# Altium schematic sheet Power Regulator.SchDoc
size A4; SheetNumber: 2; SheetTotal: 9
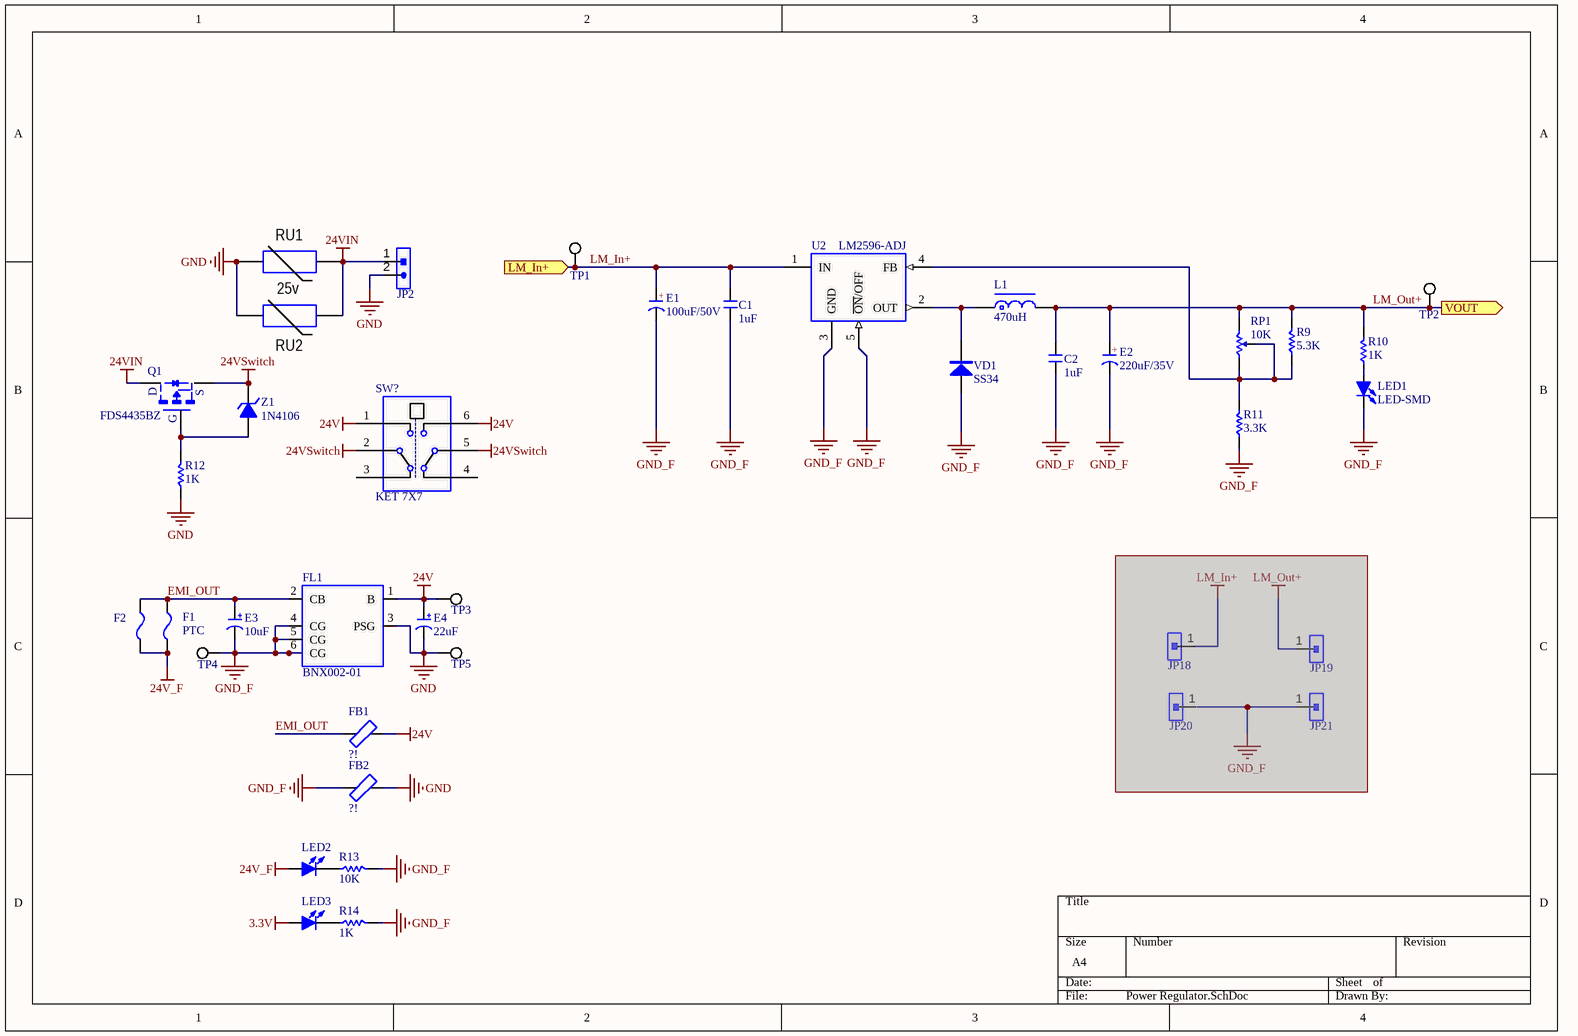
[diagram p0: Power Regulator.SchDoc]

## Parts
C1  1uF  [C 0805]
C2  1uF  [C 0805]
E1  100uF/50V  [CM E(8*10.2)]
E2  220uF/35V  [CM E(8*10.2)]
E3  10uF  [CM D(6.3*7.7)]
E4  22uF  [CM D(6.3*7.7)]
F1  PTC  [PTC]
F2  MSMD200-8V 2A  [FU 1206]  (value not drawn)
FB1  ?!  [F 1206]
FB2  ?!  [F 1206]
FL1  BNX002-01  [FIL_BNX002-01]
JP2  HDR-1X2  [KF2EDGK-2P_H_7.62]  (value not drawn)
JP18  HDR-1X1  [HDR-1X1]  (value not drawn)  (masked out: inside a compile mask, not in the netlist)
JP19  HDR-1X1  [HDR-1X1]  (value not drawn)  (masked out: inside a compile mask, not in the netlist)
JP20  HDR-1X1  [HDR-1X1]  (value not drawn)  (masked out: inside a compile mask, not in the netlist)
JP21  HDR-1X1  [HDR-1X1]  (value not drawn)  (masked out: inside a compile mask, not in the netlist)
L1  470uH  [CDRH127]
LED1  LED-SMD  [LED 0805R]
LED2  LED-SMD  [LED 0805R]  (value not drawn)
LED3  LED-SMD  [LED 0805R]  (value not drawn)
Q1  FDS4435BZ  [SOP8-E3]
R9  5.3K  [R 0805]
R10  1K  [R 0805]
R11  3.3K  [R 0805]
R12  1K  [R 0805]
R13  10K  [R 0805]
R14  1K  [R 0805]
RP1  10K  [3296W]
RU1  25v  [SMA]
RU2  *  [Varistor Short Hieght - Straight]  (value not drawn)
SW?  KET 7X7  [KFT DIP-7X7]
TP1  Test Point Pad  [TP15]  (value not drawn)
TP2  Test Point Pad  [TP15]  (value not drawn)
TP3  Test Point Pad  [TP15]  (value not drawn)
TP4  Test Point Pad  [TP15]  (value not drawn)
TP5  Test Point Pad  [TP15]  (value not drawn)
U2  LM2596-ADJ  [TO263-5A]
VD1  SS34  [SMA]
Z1  1N4106  [DO-213AA]

## Ports
LM_In+ (in), VOUT (out)

## Nets
3.3V: LED3.1(A)
24V: E4.1(A) FB1.2 FL1.1(B) SW?.1 SW?.6 TP3.1
24V_F: F1.1 F2.1 LED2.1(A)
24VIN: JP2.1 Q1.5-8(D) RU1.2 RU2.2
24VSwitch: Q1.1-3(S) SW?.2 SW?.5 Z1.2(K)
GND: E4.2(K) FB2.2 FL1.3(PSG) JP2.2 R12.1 RU1.1 RU2.1 TP5.1
GND_F: C1.1 C2.1 E1.2(K) E2.2(K) E3.2(K) FB2.1 FL1.4(CG) FL1.5(CG) FL1.6(CG) LED1.2(K) R11.1 R13.2 R14.2 TP4.1 U2.3(GND) U2.5(~{ON}/OFF) VD1.1(A)
EMI_OUT: E3.1(A) F1.2 F2.2 FB1.1 FL1.2(CB)
LM_In+: C1.2 E1.1(A) TP1.1 U2.1(IN) ; port LM_In+
LM_Out+: C2.2 E2.1(A) L1.2 R9.2 R10.2 RP1.2 TP2.1 ; port VOUT
NetL1_1: L1.1 U2.2(OUT) VD1.2(K)
NetLED1_1: LED1.1(A) R10.1
NetLED2_2: LED2.2(K) R13.1
NetLED3_2: LED3.2(K) R14.1
NetQ1_4: Q1.4(G) R12.2 Z1.1(A)
NetR9_1: R9.1 R11.2 RP1.1 RP1.ADJ U2.4(FB)

Not connected (* = marked no-connect by the designer): SW? 3 4

## Notes on the sheet
- (in symbol C-CM) +
- (in symbol KET 7X7) ---------------

## Library data of the parts
C1 C2 = C: Non-polar patch capacitor; BOM名称: 无极性贴片电容; 版权归属: 源创客; 学习资源: www.ooocke.com
E1-E4 = C-CM: Chip electrolytic capacitor; BOM名称: 贴片电解电容; 版权归属: 源创客; 学习资源: www.ooocke.com
F2 = FU: Chip fuse; BOM名称: 贴片保险丝; 版权归属: 源创客; 学习资源: www.ooocke.com
FB1 FB2 = FB: Ferrite Bead; BOM名称: 贴片电阻; 版权归属: 源创客; 学习资源: www.ooocke.com
FL1 = BNX002-01: LC EMI Filter 5th Order Low Pass 2 Channel 10A Block, 4 Lead; MF: Murata; Package: Block-4 Murata; Price: None; SnapEDA_Link: https://www.snapeda.com/parts/BNX002-01/Murata%20Electronics%20North%20America/view-part/12269/?ref=snap; Availability: Unavailable; Value: *; MP: BNX002-01
JP2 = Header 2: 2P Connector; BOM名称: 2P接插件; 版权归属: 源创客; 学习资源: www.ooocke.com
JP18-JP21 = Header 1: 1P Connector; BOM名称: 1P接插件; 版权归属: 源创客; 学习资源: www.ooocke.com
L1 = L-CDRH: Power shielded inductor; BOM名称: 功率屏蔽电感; 版权归属: 源创客; 学习资源: www.ooocke.com
LED1-LED3 = LED-SMD: Patch LED; BOM名称: 贴片LED; 版权归属: 源创客; 学习资源: www.ooocke.com
R9-R14 = R: Chip resistor; 版权归属: 源创客; BOM名称: Chip resistor; 学习资源: www.ooocke.com
RP1 = RP-THD: Plug-in potentiometer; BOM名称: 插件电位器; 版权归属: 源创客; 学习资源: www.ooocke.com
RU1 RU2 = V: Versiror; Manufacturer: *; Model: *; HelpURL: *; ComponentKind: *; Value: *
SW? = KET 7X7: 7*7 switch; BOM名称: 7*7开关; 版权归属: 源创客; 学习资源: www.ooocke.com
TP1-TP5 = Test Point Pad: Company: SJ Libraries; Designer: Eng. Saeid Jorablo; Rule: UNIONINDEX=0|RULEKIND=ComponentClearance|NETSCOPE=AnyNet|LAYERKIND=SameLayer|NAME=Schematic Component Clearance Constraint|GAP=0mil|COLLISIONCHECKMODE=3|VERTICALGAP=0mil|SHOWDISTANCES=FALSE|UNIT=Imperial; Mounting Technology: Surface Mount\Through-Hole; ComponentLink1Description: Datasheet; Pin Count: 0; Update Date: 6/3/2012; Category: MISC; HelpURL: http://s3.picofile.com/file/7443264187/Coming_Soon_logo.gif
U2 = LM2596: DC step-down chip; BOM名称: DC稳压芯片; 版权归属: 源创客; 学习资源: www.ooocke.com
VD1 = SS34: Schottky diodes; BOM名称: 肖特基二极管; 版权归属: 源创客; 属性: 40V/3A; 学习资源: www.ooocke.com
Z1 = 1N4106: 12V/0.5W voltage regulator; BOM名称: 12V/0.5W稳压管; 版权归属: 源创客; 学习资源: www.ooocke.com